# Altium schematic sheet Banks_1_2.SchDoc: FPGA Motherboard for Digital Multiplexed Readout, McGill U.
size Tabloid; DocumentNumber: DfMUX2; Revision: Rev0, Prototype; SheetNumber: 2; SheetTotal: 27; PageSetup: Record=PageOptions|CenterHorizontal=True|CenterVertical=True|PrintScale=0.65|XCorrection=1.00|YCorrection=1.00|PrintKind=0|BorderSize=5000000|LeftOffset=0|BottomOffset=0|Orientation=2|PaperLength=1000|PaperWidth=1000|Scale=100|PaperSource=7|PrintQuality=-4|MediaType=1|DitherType=10|PaperKind=A4|PrintScaleMode=1
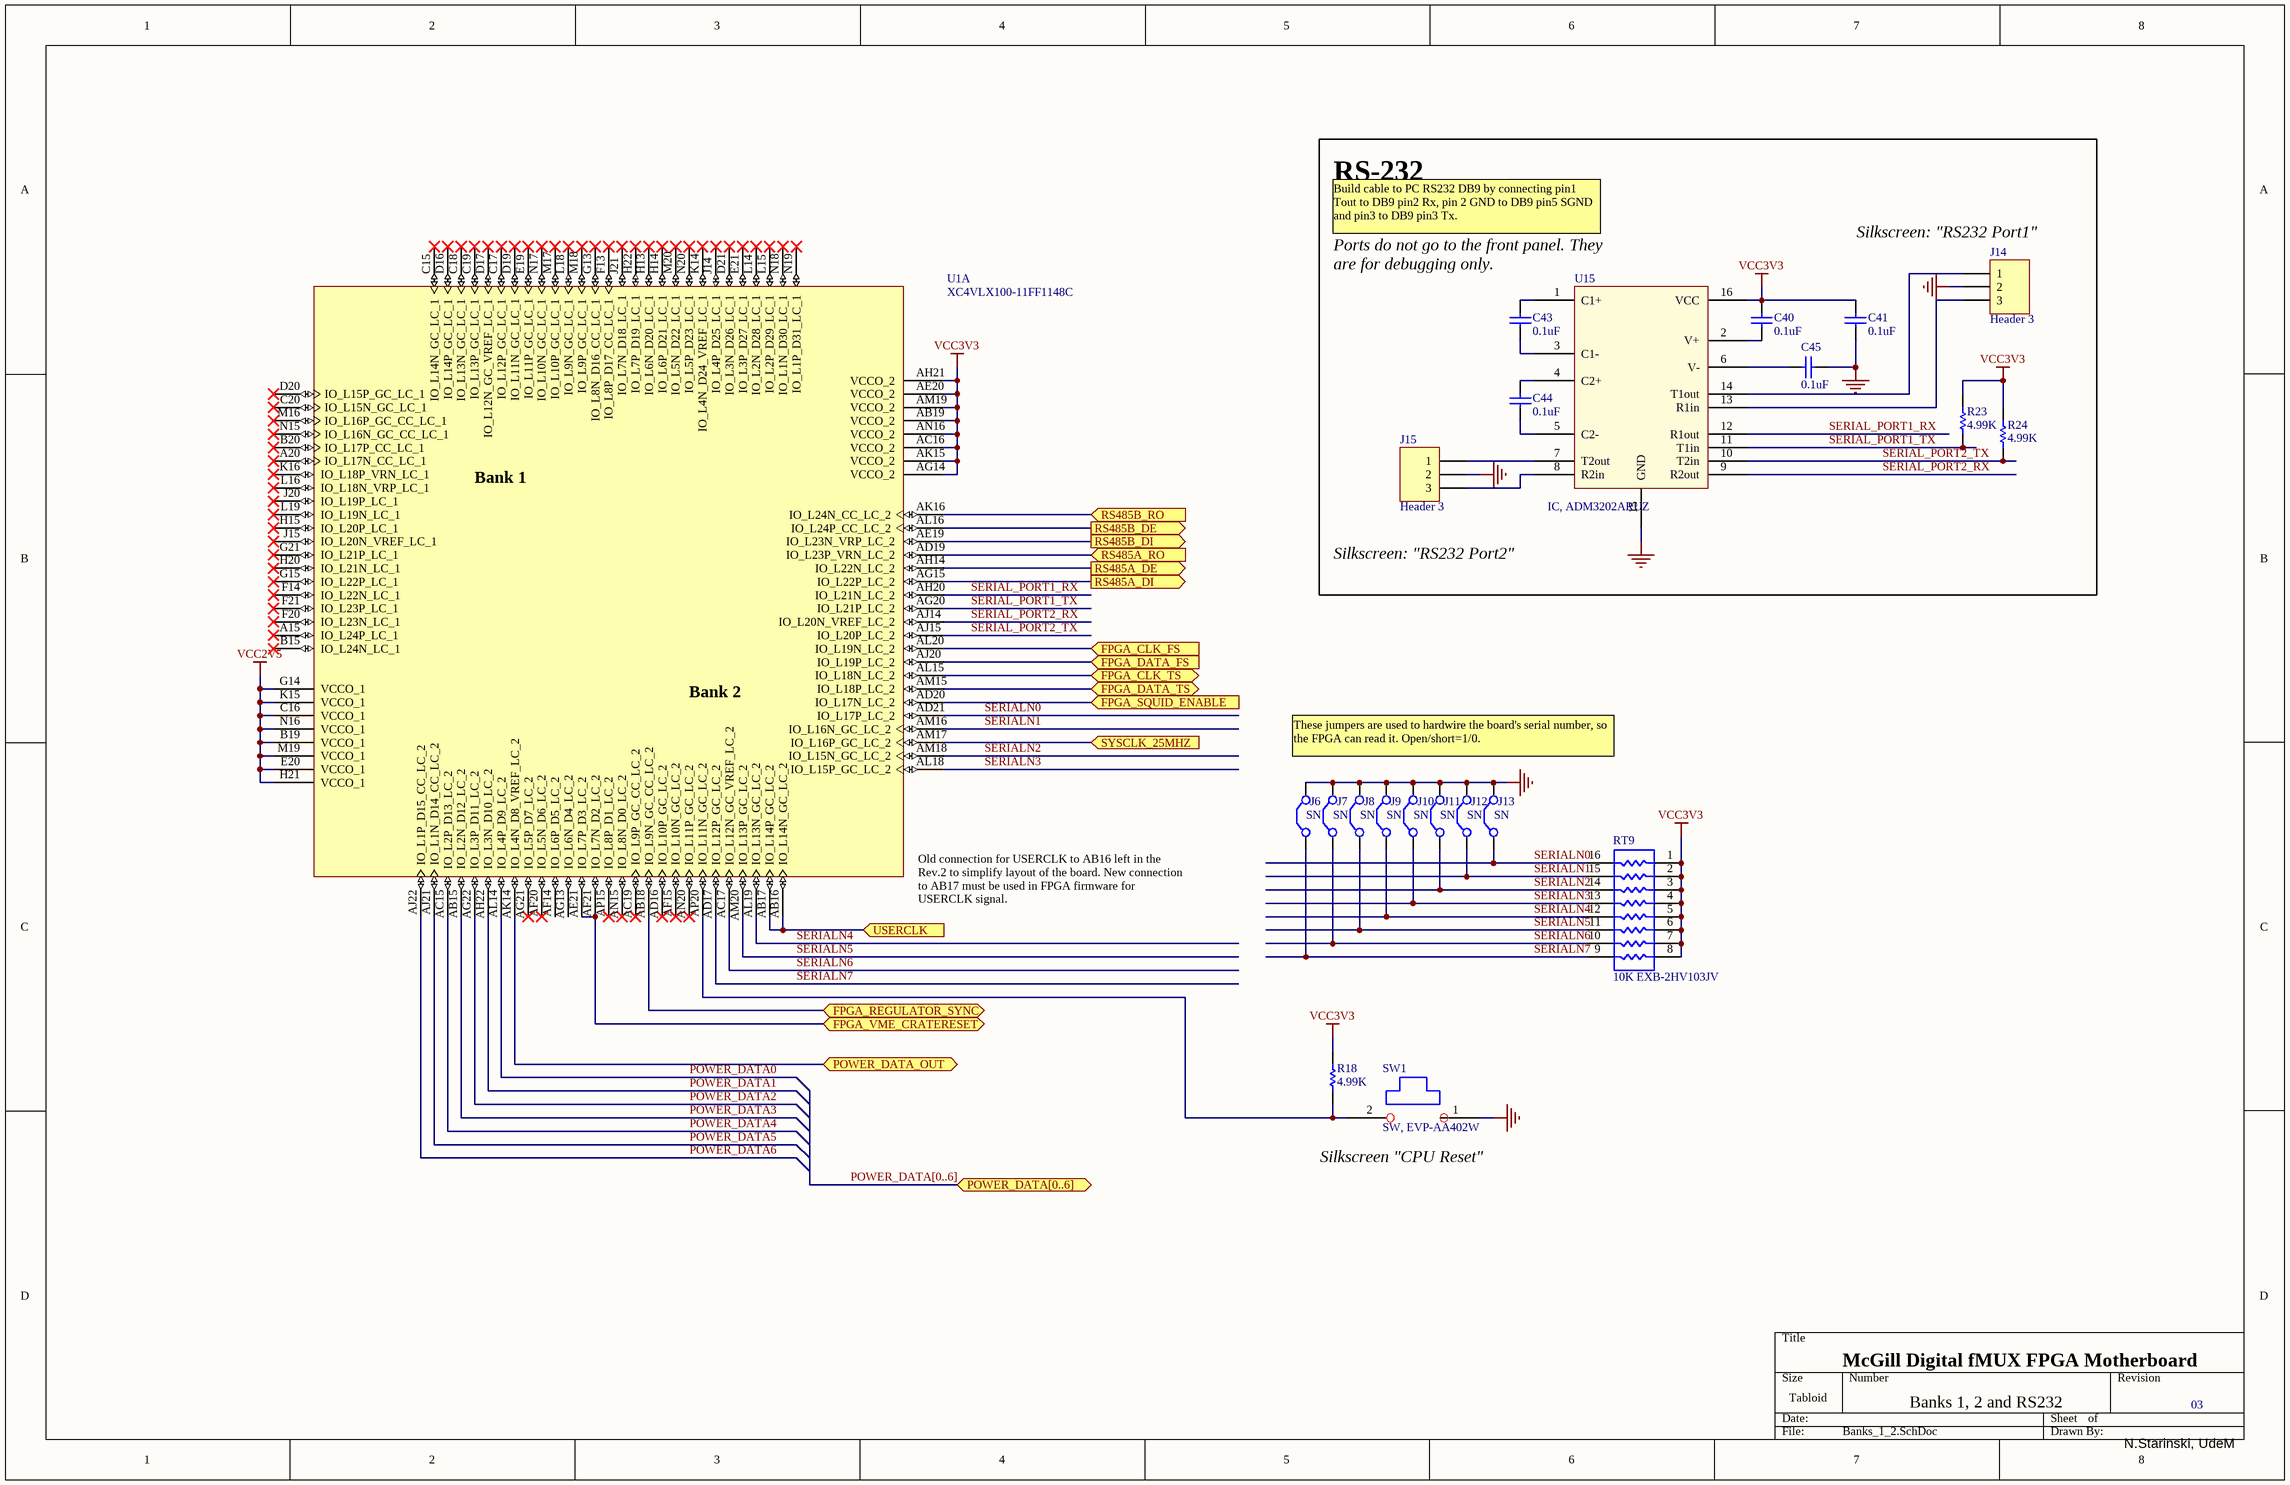
[diagram p0: Banks_1_2.SchDoc]

## Parts
C40  0.1uF  [CC1608-0603]
C41  0.1uF  [CC1608-0603]
C43  0.1uF  [CC1608-0603]
C44  0.1uF  [CC1608-0603]
C45  0.1uF  [CC1608-0603]
J6  SN  [MHDR1X2]
J7  SN  [MHDR1X2]
J8  SN  [MHDR1X2]
J9  SN  [MHDR1X2]
J10  SN  [MHDR1X2]
J11  SN  [MHDR1X2]
J12  SN  [MHDR1X2]
J13  SN  [MHDR1X2]
J14  Header 3  [HDR1X3]
J15  Header 3  [HDR1X3]
R18  4.99K  [CR1608-0603]
R23  4.99K  [CR1608-0603]
R24  4.99K  [CR1608-0603]
RT9  10K EXB-2HV103JV  [0402_Array_2HV]
SW1  SW, EVP-AA402W  [EVPAA]
U1  XC4VLX100-11FF1148C  [FF1148]  (part A of 10)
U15  IC, ADM3202ARUZ  [SSO-G16/X.45]

## Ports
FPGA_CLK_FS (in), FPGA_CLK_TS (bidir), FPGA_DATA_FS (in), FPGA_DATA_TS (bidir), FPGA_REGULATOR_SYNC (bidir), FPGA_SQUID_ENABLE (in), FPGA_VME_CRATERESET (bidir), POWER_DATA[0..6], POWER_DATA_OUT (bidir), RS485A_DE (out), RS485A_DI (out), RS485A_RO (in), RS485B_DE (out), RS485B_DI (out), RS485B_RO (in), SYSCLK_25MHZ (in), USERCLK (in)

## Nets
GND: C41.1 C45.2 J6.2(C2) J7.2(C2) J8.2(C2) J9.2(C2) J10.2(C2) J11.2(C2) J12.2(C2) J13.2(C2) J14.2 J15.2 SW1.1 U15.15(GND)
VCC2V5: U1.B19(VCCO_1) U1.C16(VCCO_1) U1.E20(VCCO_1) U1.G14(VCCO_1) U1.H21(VCCO_1) U1.K15(VCCO_1) U1.M19(VCCO_1) U1.N16(VCCO_1)
VCC3V3: C40.2 C41.2 R18.2 R23.2 R24.2 RT9.1 RT9.2 RT9.3 RT9.4 RT9.5 RT9.6 RT9.7 RT9.8 U1.AB19(VCCO_2) U1.AC16(VCCO_2) U1.AE20(VCCO_2) U1.AG14(VCCO_2) U1.AH21(VCCO_2) U1.AK15(VCCO_2) U1.AM19(VCCO_2) U1.AN16(VCCO_2) U15.16(VCC)
FPGA_CLK_FS: U1.AL20(IO_L19N_LC_2) ; port FPGA_CLK_FS
FPGA_CLK_TS: U1.AL15(IO_L18N_LC_2) ; port FPGA_CLK_TS
FPGA_DATA_FS: U1.AJ20(IO_L19P_LC_2) ; port FPGA_DATA_FS
FPGA_DATA_TS: U1.AM15(IO_L18P_LC_2) ; port FPGA_DATA_TS
FPGA_REGULATOR_SYNC: U1.AB18(IO_L9N_GC_CC_LC_2) ; port FPGA_REGULATOR_SYNC
FPGA_SQUID_ENABLE: U1.AD20(IO_L17N_LC_2) ; port FPGA_SQUID_ENABLE
FPGA_VME_CRATERESET: U1.AE21(IO_L7P_D3_LC_2) U1.AF21(IO_L7N_D2_LC_2) ; port FPGA_VME_CRATERESET
POWER_DATA0: U1.AL14(IO_L4P_D9_LC_2)
POWER_DATA1: U1.AH22(IO_L3N_D10_LC_2)
POWER_DATA2: U1.AG22(IO_L3P_D11_LC_2)
POWER_DATA3: U1.AB15(IO_L2N_D12_LC_2)
POWER_DATA4: U1.AC15(IO_L2P_D13_LC_2)
POWER_DATA5: U1.AJ21(IO_L1N_D14_CC_LC_2)
POWER_DATA6: U1.AJ22(IO_L1P_D15_CC_LC_2)
POWER_DATA_OUT: U1.AK14(IO_L4N_D8_VREF_LC_2) ; port POWER_DATA_OUT
RS485A_DE: U1.AH14(IO_L22N_LC_2) ; port RS485A_DE
RS485A_DI: U1.AG15(IO_L22P_LC_2) ; port RS485A_DI
RS485A_RO: U1.AD19(IO_L23P_VRN_LC_2) ; port RS485A_RO
RS485B_DE: U1.AL16(IO_L24P_CC_LC_2) ; port RS485B_DE
RS485B_DI: U1.AE19(IO_L23N_VRP_LC_2) ; port RS485B_DI
RS485B_RO: U1.AK16(IO_L24N_CC_LC_2) ; port RS485B_RO
SERIAL_PORT1_RX: U1.AH20(IO_L21N_LC_2) U15.12(R1out)
SERIAL_PORT1_TX: R23.1 U1.AG20(IO_L21P_LC_2) U15.11(T1in)
SERIAL_PORT2_RX: U1.AJ14(IO_L20N_VREF_LC_2) U15.9(R2out)
SERIAL_PORT2_TX: R24.1 U1.AJ15(IO_L20P_LC_2) U15.10(T2in)
SERIALN0: J13.1(C1) RT9.16 U1.AD21(IO_L17P_LC_2)
SERIALN1: J12.1(C1) RT9.15 U1.AM16(IO_L16N_GC_LC_2)
SERIALN2: J11.1(C1) RT9.14 U1.AM18(IO_L15N_GC_LC_2)
SERIALN3: J10.1(C1) RT9.13 U1.AL18(IO_L15P_GC_LC_2)
SERIALN4: J9.1(C1) RT9.12 U1.AL19(IO_L13N_GC_LC_2)
SERIALN5: J8.1(C1) RT9.11 U1.AM20(IO_L13P_GC_LC_2)
SERIALN6: J7.1(C1) RT9.10 U1.AC17(IO_L12N_GC_VREF_LC_2)
SERIALN7: J6.1(C1) RT9.9 U1.AD17(IO_L12P_GC_LC_2)
SYSCLK_25MHZ: U1.AM17(IO_L16P_GC_LC_2) ; port SYSCLK_25MHZ
USERCLK: U1.AB16(IO_L14N_GC_LC_2) U1.AB17(IO_L14P_GC_LC_2) ; port USERCLK
NetC40_1: C40.1 U15.2(V+)
NetC43_1: C43.1 U15.3(C1-)
NetC43_2: C43.2 U15.1(C1+)
NetC44_1: C44.1 U15.5(C2-)
NetC44_2: C44.2 U15.4(C2+)
NetC45_1: C45.1 U15.6(V-)
NetJ14_1: J14.1 U15.14(T1out)
NetJ14_3: J14.3 U15.13(R1in)
NetJ15_1: J15.1 U15.7(T2out)
NetJ15_3: J15.3 U15.8(R2in)
NetR18_1: R18.1 SW1.2 U1.AP20(IO_L11N_GC_LC_2)

Not connected (* = marked no-connect by the designer): U1 A15(IO_L24P_LC_1)* A20(IO_L17N_CC_LC_1)* AC19(IO_L9P_GC_CC_LC_2)* AD16(IO_L10P_GC_LC_2)* AF14(IO_L6P_D5_LC_2) AF15(IO_L10N_GC_LC_2)* AF20(IO_L5N_D6_LC_2)* AG13(IO_L6N_D4_LC_2) AG21(IO_L5P_D7_LC_2)* AN15(IO_L8N_D0_LC_2)* AN20(IO_L11P_GC_LC_2)* AP15(IO_L8P_D1_LC_2)* B15(IO_L24N_LC_1)* B20(IO_L17P_CC_LC_1)* C15(IO_L14N_GC_LC_1)* C17(IO_L12P_GC_LC_1)* C18(IO_L13N_GC_LC_1)* C19(IO_L13P_GC_LC_1)* C20(IO_L15N_GC_LC_1)* D16(IO_L14P_GC_LC_1)* D17(IO_L12N_GC_VREF_LC_1)* D19(IO_L11N_GC_LC_1)* D20(IO_L15P_GC_LC_1)* D21(IO_L3N_D26_LC_1)* E19(IO_L11P_GC_LC_1)* E21(IO_L3P_D27_LC_1)* F13(IO_L8P_D17_CC_LC_1)* F14(IO_L22N_LC_1)* F20(IO_L23N_LC_1)* F21(IO_L23P_LC_1)* G13(IO_L8N_D16_CC_LC_1)* G15(IO_L22P_LC_1)* G21(IO_L21P_LC_1)* H13(IO_L6N_D20_LC_1)* H14(IO_L6P_D21_LC_1)* H15(IO_L20P_LC_1)* H20(IO_L21N_LC_1)* H22(IO_L7P_D19_LC_1)* J14(IO_L4P_D25_LC_1)* J15(IO_L20N_VREF_LC_1)* J20(IO_L19P_LC_1)* J21(IO_L7N_D18_LC_1)* K14(IO_L4N_D24_VREF_LC_1)* K16(IO_L18P_VRN_LC_1)* L14(IO_L2N_D28_LC_1)* L15(IO_L2P_D29_LC_1)* L16(IO_L18N_VRP_LC_1)* L18(IO_L9N_GC_LC_1)* L19(IO_L19N_LC_1)* M16(IO_L16P_GC_CC_LC_1)* M17(IO_L10P_GC_LC_1)* M18(IO_L9P_GC_LC_1)* M20(IO_L5N_D22_LC_1)* N15(IO_L16N_GC_CC_LC_1)* N17(IO_L10N_GC_LC_1)* N18(IO_L1N_D30_LC_1)* N19(IO_L1P_D31_LC_1)* N20(IO_L5P_D23_LC_1)*

## Buses and harness runs
bus POWER_DATA[0..6] = port POWER_DATA[0..6]

## Notes on the sheet
- RS-232
- Build cable to PC RS232 DB9 by connecting pin1 Tout to DB9 pin2 Rx, pin 2 GND to DB9 pin5 SGND and pin3 to DB9 pin3 Tx.
- Ports do not go to the front panel. They are for debugging only.
- (near J14) Silkscreen: "RS232 Port1"
- Silkscreen: "RS232 Port2"
- These jumpers are used to hardwire the board's serial number, so the FPGA can read it. Open/short=1/0.
- (near U1) Old connection for USERCLK to AB16 left in the Rev.2 to simplify layout of the board. New connection to AB17 must be used in FPGA firmware for USERCLK signal.
- (near SW1) Silkscreen "CPU Reset"
- McGill Digital fMUX FPGA Motherboard
- Banks 1, 2 and RS232
- 03
- N.Starinski, UdeM
- (in symbol XC4VLX100-11FF1148C, part A) Bank 1; Bank 2

## Library data of the parts
C40 C41 C43-C45 = Cap Semi: Capacitor (Semiconductor SIM Model); Published: 8-Jun-2000; LatestRevisionDate: 17-Jul-2002; LatestRevisionNote: Re-released for DXP Platform.; PackageReference: C1206; Publisher: Altium Limited
J6-J13 = Jumper: Jumper Wire - Assembly house please short.; Published: 24-Mar-1999; LatestRevisionDate: 17-Jul-2002; LatestRevisionNote: Re-released for DXP Platform.; Publisher: Altium Limited
J14 J15 = Header 3: Header, 0.1"  3-Pin straight; LatestRevisionDate: 17-Jul-2002; LatestRevisionNote: Re-released for DXP Platform.; Publisher: Altium Limited
R18 R23 R24 = Res Semi: Resistor 0603; Published: 8-Jun-2000; LatestRevisionDate: 17-Jul-2002; LatestRevisionNote: Re-released for DXP Platform.; Publisher: Altium Limited
RT9 = Res Pack3: Isolated Resistor Network; Published: 24-Mar-1999; LatestRevisionDate: 17-Jul-2002; LatestRevisionNote: Re-released for DXP Platform.; Publisher: Altium Limited
SW1 = Tiny Pushbutton Switch: Switch, SM pushbutton SPST
U1 = XC4VLX100-11FF1148C: Xilinx Virtex-4 LX Platform FPGA, 1148-Ball FFBGA, Speed Grade 11, 768 User I/Os, Commercial Grade; PackageDocument: ver1.0, Oct-2002; Published: 13-Dec-2004; LatestRevisionDate: 4-Mar-2005; LatestRevisionNote: D_IN & CS_B pins changed from I/O to Input. DOUT_BUSY pin changed from I/O to Output.; DatasheetDocument: ver1.2, Dec-2004; PackageReference: FF1148; Publisher: Altium Limited; ComponentLink2Description: Virtex-4 Overview; ComponentLink2URL: http://www.xilinx.com/products/virtex4/overview.htm; ComponentLink3Description: Datasheet; ComponentLink3URL: http://direct.xilinx.com/bvdocs/userguides/ug075.pdf; Code_JEDEC: MS-034-AAR-1
U15 = ADM3202: Line Drivers/Receivers